# Altium schematic sheet MCU.SchDoc: STM32F446 Development Board
size A4; DrawnBy: EEE Patrcik; Organization: PERT; Revision: A; SheetNumber: 2; SheetTotal: 3; Version: 1; Sub Team: EEE; Module: BMS; Generation: NA
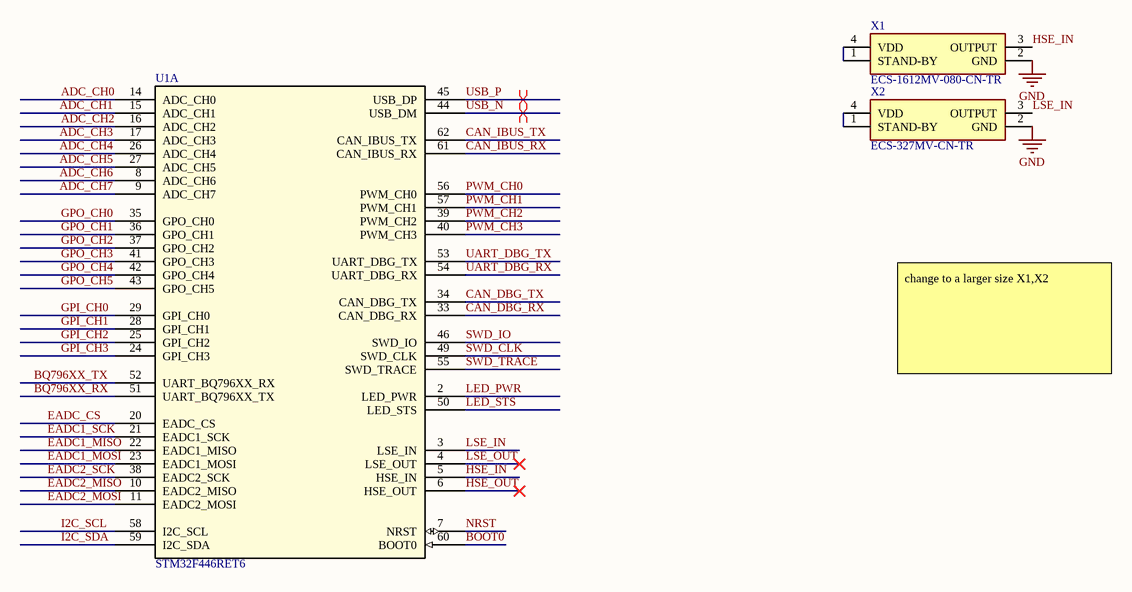
[diagram p0: MCU.SchDoc]

## Parts
U1  STM32F446RET6  [LQFP64-STM32F446]  (part A of 2)
X1  ECS-1612MV-080-CN-TR  [1612_OSXO_80]
X2  ECS-327MV-CN-TR  [1612_OSXO_32.768]

## Nets
GND: X1.2(GND) X2.2(GND)
ADC_CH0: U1.14(ADC_CH0)
ADC_CH1: U1.15(ADC_CH1)
ADC_CH2: U1.16(ADC_CH2)
ADC_CH3: U1.17(ADC_CH3)
ADC_CH4: U1.26(ADC_CH4)
ADC_CH5: U1.27(ADC_CH5)
ADC_CH6: U1.8(ADC_CH6)
ADC_CH7: U1.9(ADC_CH7)
BOOT0: U1.60(BOOT0)
BQ796XX_RX: U1.51(UART_BQ796XX_TX)
BQ796XX_TX: U1.52(UART_BQ796XX_RX)
CAN_DBG_RX: U1.33(CAN_DBG_RX)
CAN_DBG_TX: U1.34(CAN_DBG_TX)
CAN_IBUS_RX: U1.61(CAN_IBUS_RX)
CAN_IBUS_TX: U1.62(CAN_IBUS_TX)
EADC1_MISO: U1.22(EADC1_MISO)
EADC1_MOSI: U1.23(EADC1_MOSI)
EADC1_SCK: U1.21(EADC1_SCK)
EADC2_MISO: U1.10(EADC2_MISO)
EADC2_MOSI: U1.11(EADC2_MOSI)
EADC2_SCK: U1.38(EADC2_SCK)
EADC_CS: U1.20(EADC_CS)
GPI_CH0: U1.29(GPI_CH0)
GPI_CH1: U1.28(GPI_CH1)
GPI_CH2: U1.25(GPI_CH2)
GPI_CH3: U1.24(GPI_CH3)
GPO_CH0: U1.35(GPO_CH0)
GPO_CH1: U1.36(GPO_CH1)
GPO_CH2: U1.37(GPO_CH2)
GPO_CH3: U1.41(GPO_CH3)
GPO_CH4: U1.42(GPO_CH4)
GPO_CH5: U1.43(GPO_CH5)
HSE_IN: U1.5(HSE_IN) X1.3(OUTPUT)
HSE_OUT: U1.6(HSE_OUT)
I2C_SCL: U1.58(I2C_SCL)
I2C_SDA: U1.59(I2C_SDA)
LED_PWR: U1.2(LED_PWR)
LED_STS: U1.50(LED_STS)
LSE_IN: U1.3(LSE_IN) X2.3(OUTPUT)
LSE_OUT: U1.4(LSE_OUT)
NRST: U1.7(NRST)
PWM_CH0: U1.56(PWM_CH0)
PWM_CH1: U1.57(PWM_CH1)
PWM_CH2: U1.39(PWM_CH2)
PWM_CH3: U1.40(PWM_CH3)
SWD_CLK: U1.49(SWD_CLK)
SWD_IO: U1.46(SWD_IO)
SWD_TRACE: U1.55(SWD_TRACE)
UART_DBG_RX: U1.54(UART_DBG_RX)
UART_DBG_TX: U1.53(UART_DBG_TX)
USB_N: U1.44(USB_DM)
USB_P: U1.45(USB_DP)
NetX1_1: X1.1(STAND-BY) X1.4(VDD)
NetX2_1: X2.1(STAND-BY) X2.4(VDD)

## Layout directives
differential pair: USB_N, USB_P

## Notes on the sheet
- change to a larger size X1,X2
- Title
- Generation
- Organization
- Sub Team
- Module
- Ver.
- Rev.
- Date
- Drawn By

## Library data of the parts
U1 = STM32F446RET6: No Description Available; Mfr_Name: STMicroelectronics; Copyright: Copyright (C) 2023 Ultra Librarian. All rights reserved.; Manufacturer_Part_Number: STM32F446RET6; RefDes: RefDes; Type: DEV
X1 = 8M OSXO ECS: Standard Clock Oscillators 8MHz CMOS 1.6-3.6V; Manufacturer_Name: ECS; Geometry.Height: 0.7mm; Mouser Part Number: 520-1612MV-080-CNT; Mouser Price/Stock: https://www.mouser.co.uk/ProductDetail/ECS/ECS-1612MV-080-CN-TR?qs=MLItCLRbWswg5aTynjLSEQ%3D%3D; Manufacturer_Part_Number: ECS-1612MV-080-CN-TR; Datasheet Link: https://www.arrow.com/en/products/ecs-1612mv-080-cn-tr/ecs-international
X2 = 32.768k OSXO ECS: Standard Clock Oscillators 32.768kHz LVCMOS 1.6-3.6V; Manufacturer_Name: ECS; Geometry.Height: 0.7mm; Mouser Part Number: 520-327MV-CNT; Mouser Price/Stock: https://www.mouser.co.uk/ProductDetail/ECS/ECS-327MV-CN-TR?qs=MLItCLRbWswJ3OzWTZUbfw%3D%3D; Manufacturer_Part_Number: ECS-327MV-CN-TR; Datasheet Link: https://datasheet.datasheetarchive.com/originals/dk/DKDS42/DSANUWW0043417.pdf